# Altium schematic sheet Alimentation_USB_Header.SchDoc
size Tabloid; DocumentNumber: 3; SheetNumber: 3; SheetTotal: 7; Sheet_Name: Schéma_Bloc; Size: 11x17
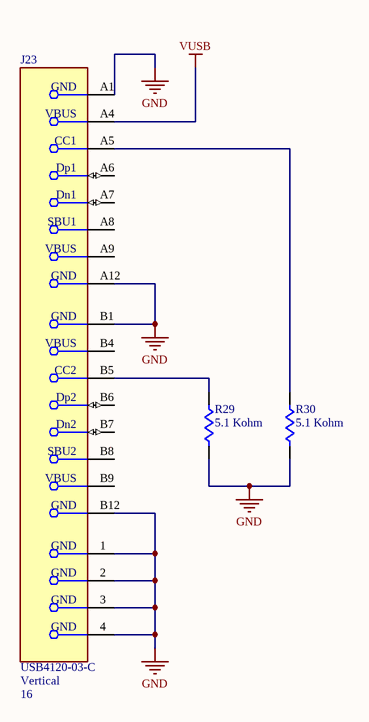
[diagram p0: Alimentation_USB_Header.SchDoc]

## Parts
J23  USB4120-03-C  Orientation: Vertical  Number of Pins: 16  [FP-USB4120-03-C-MFG]
R29  5.1 Kohm  [Res_Template]
R30  5.1 Kohm  [Res_Template]

## Nets
GND: J23.1(GND) J23.2(GND) J23.3(GND) J23.4(GND) J23.A1(GND) J23.A12(GND) J23.B1(GND) J23.B12(GND) R29.1 R30.1
VUSB: J23.A4(VBUS)
NetJ23_A5: J23.A5(CC1) R30.2
NetJ23_B5: J23.B5(CC2) R29.2

Not connected (* = marked no-connect by the designer): J23 A6(Dp1) A7(Dn1) A8(SBU1) A9(VBUS) B4(VBUS) B6(Dp2) B7(Dn2) B8(SBU2) B9(VBUS)

## Notes on the sheet
- Nom de la feuille
- Titre du projet
- Cours associé au projet
- Taille
- Département
- Technologies du
- Révision
- PCB
- .
- SCH
- Date
- génie électrique
- Feuille
- Variant
- de
- Concepteurs

## Library data of the parts
J23 = CMP-03329-113696351-1: USB4120-03-C 16 Position 48 VDC USB Type C Vertical USB 2.0 Receptacle Connector; NexarPartId: 113696351
R29 R30 = 470 ohm: Custom Semiconductor Resistor